# Altium schematic sheet 01_Power.SchDoc
size A4
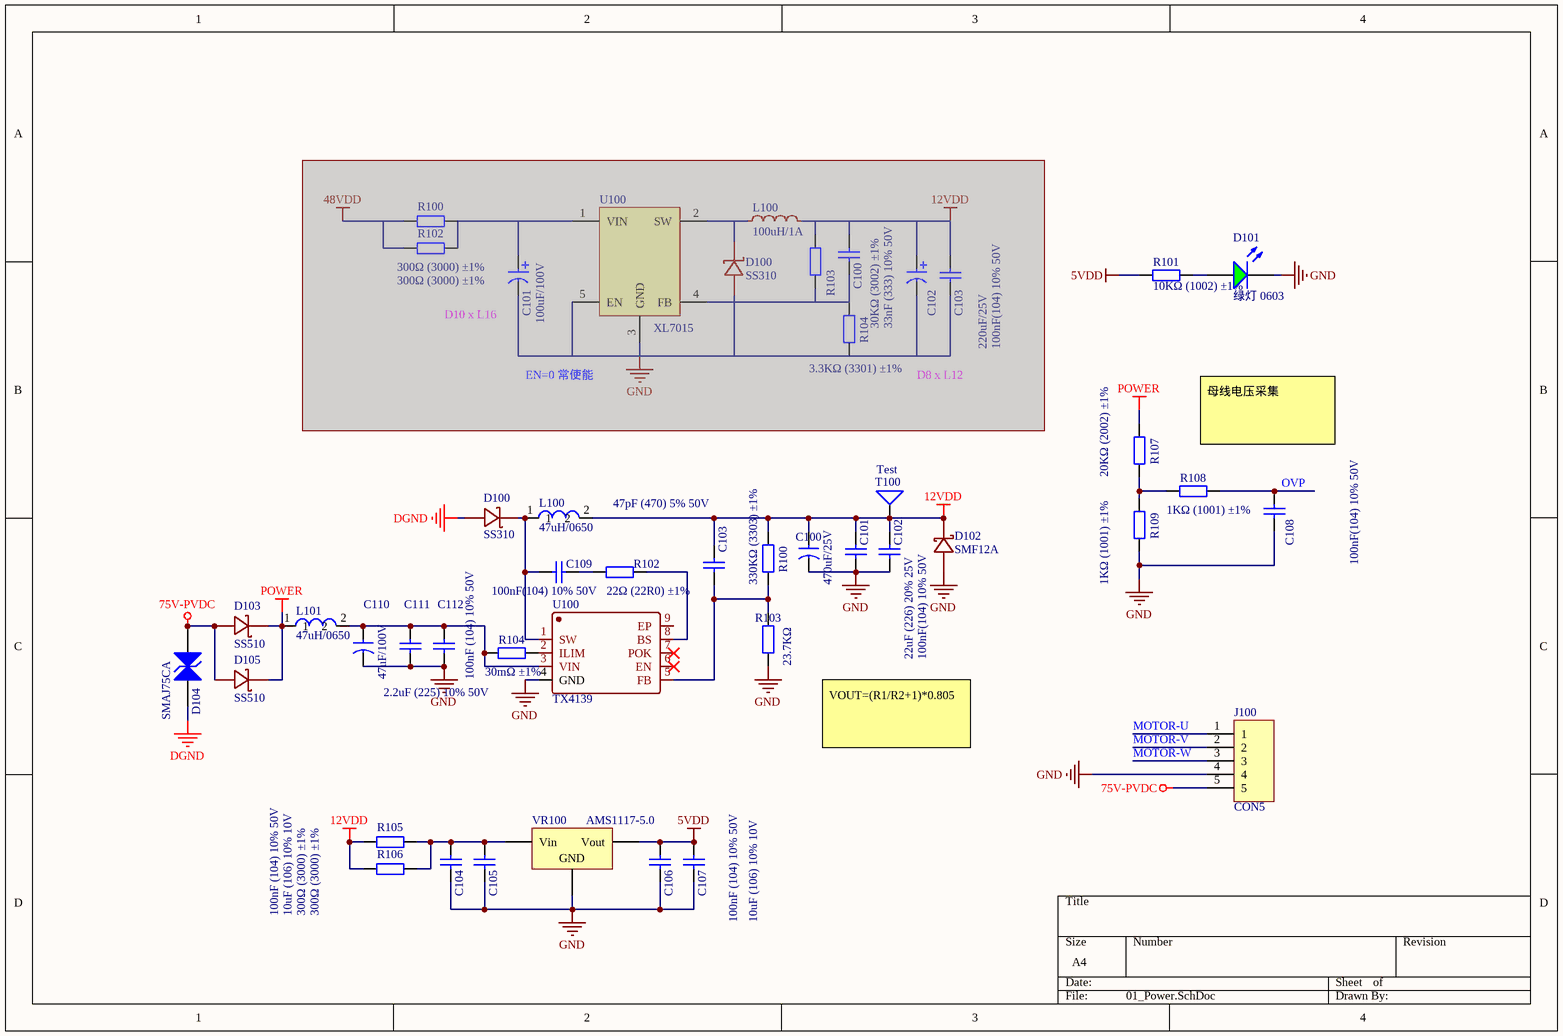
[diagram p0: 01_Power.SchDoc]

## Parts
(Parts that share a designator on the sheet are numbered #1, #2 ... from top to bottom, then left to right.)
C100#1  33nF (333) 10% 50V  [0603_C]  (masked out: inside a compile mask, not in the netlist)
C100#2  470uF/25V  [47UF/100V]
C101#1  100uF/100V  [CAP_D10_L16]  (masked out: inside a compile mask, not in the netlist)
C101#2  22uF (226) 20% 25V  [0805_C]
C102#1  220uF/25V  [CAP_D8_L12]  (masked out: inside a compile mask, not in the netlist)
C102#2  100nF(104) 10% 50V  [0805_C]
C103#1  100nF(104) 10% 50V  [0805_C]  (masked out: inside a compile mask, not in the netlist)
C103#2  47pF (470) 5% 50V  [0805_C]
C104  100nF (104) 10% 50V  [0603_C]
C105  10uF (106) 10% 10V  [0603_C]
C106  100nF (104) 10% 50V  [0603_C]
C107  10uF (106) 10% 10V  [0603_C]
C108  100nF(104) 10% 50V  [0805_C]
C109  100nF(104) 10% 50V  [0805_C]
C110  47uF/100V  [47UF/100V]
C111  2.2uF (225) 10% 50V  [1206_C]
C112  100nF (104) 10% 50V  [1206_C]
D100#1  SS310  [SS310]  (masked out: inside a compile mask, not in the netlist)
D100#2  SS310  [SS310]
D101  绿灯 0603  [0603_LED_S1]
D102  SMF12A  [SMF12A - duplicate]
D103  SS510  [SS510]
D104  SMAJ75CA  [SMB(DO-214AA)_S1]
D105  SS510  [SS510]
J100  CON5  [7.62-5P 端子]
L100#1  100uH/1A  [L_D9.5_L12]  (masked out: inside a compile mask, not in the netlist)
L100#2  47uH/0650  [0650_47uH]
L101  47uH/0650  [0650_47uH]
R100#1  300Ω (3000) ±1%  [1206_R]  (masked out: inside a compile mask, not in the netlist)
R100#2  330KΩ (3303) ±1%  [0805_R]
R101  10KΩ (1002) ±1%  [0603_R]
R102#1  300Ω (3000) ±1%  [1206_R]  (masked out: inside a compile mask, not in the netlist)
R102#2  22Ω (22R0) ±1%  [0805_R]
R103#1  30KΩ (3002) ±1%  [0603_R]  (masked out: inside a compile mask, not in the netlist)
R103#2  23.7KΩ  [0805_R]
R104#1  3.3KΩ (3301) ±1%  [0603_R]  (masked out: inside a compile mask, not in the netlist)
R104#2  30mΩ ±1%  [LC-0603_R]
R105  300Ω (3000) ±1%  [1206_R]
R106  300Ω (3000) ±1%  [1206_R]
R107  20KΩ (2002) ±1%  [0805_R]
R108  1KΩ (1001) ±1%  [0805_R]
R109  1KΩ (1001) ±1%  [0805_R]
T100  Test  [Testpoint]
U100#1  XL7015  [XL7015]  (masked out: inside a compile mask, not in the netlist)
U100#2  TX4139  [ESOP8]
VR100  AMS1117-5.0  [SOT-223]

## Nets
5VDD: C106.2 C107.2 R101.2 VR100.2(Vout)
12VDD: C100#2.1 C101#2.2 C102#2.2 C103#2.2 D102.1(K) L100#2.2 R100#2.2 R105.1 R106.1 T100.1
75V-PVDC: D103.2 D104.1(A) D105.2 J100.5
DGND: D100#2.2(A) D104.2(K)
GND: C100#2.2 C101#2.1 C102#2.1 C104.1 C105.1 C106.1 C107.1 C108.1 C110.2 C111.1 C112.1 D101.K D102.2(A) J100.4 R103#2.1 R109.1 U100#2.4(GND) VR100.1(GND)
POWER: D103.1 D105.1 L101.1 R107.2
MOTOR-U: J100.1
MOTOR-V: J100.2
MOTOR-W: J100.3
OVP: C108.2 R108.1
NetC103#2_1: C103#2.1 R100#2.1 R103#2.2 U100#2.5(FB)
NetC104_2: C104.2 C105.2 R105.2 R106.2 VR100.3(Vin)
NetC109_1: C109.1 D100#2.1(K) L100#2.1 U100#2.1(SW)
NetC109_2: C109.2 R102#2.1
NetC110_1: C110.1 C111.2 C112.2 L101.2 R104#2.2 U100#2.3(VIN)
NetD101_A: D101.A R101.1
NetR102#2_2: R102#2.2 U100#2.8(BS)
NetR104#2_1: R104#2.1 U100#2.2(ILIM)
NetR107_1: R107.1 R108.2 R109.2

Not connected (* = marked no-connect by the designer): U100#2 6(EN)* 7(POK)* 9(EP)

## Notes on the sheet
- (near C101#1) D10 x L16
- EN=0 常使能
- D8 x L12
- 母线电压采集
- VOUT=(R1/R2+1)*0.805

## Library data of the parts
C100#1 = 0603 33nF (333) 10% 50V: 贴片电容; ComponentLink1Description: 供应商链接; ComponentLink1URL: http://www.szlcsc.com/product/details_21829.html; Package: 0603; Supplier: LC; SuppliersPartNumber: C21117
C100#2 C110 = CapSMT220u_16V
C101#1 C102#1 = CAP2: 电解电容
C101#2 = 0805 22uF (226) 20% 25V: 贴片电容; ComponentLink1Description: 供应商链接; ComponentLink1URL: http://www.szlcsc.com/product/details_46786.html; Package: 0805; Supplier: LC; SuppliersPartNumber: C45783
C102#2 C103#1 C108 C109 = 0805 100nF(104) 10% 50V: 贴片电容; ComponentLink1Description: 供应商链接; ComponentLink1URL: http://www.szlcsc.com/product/details_50686.html; Package: 0805; Supplier: LC; SuppliersPartNumber: C49678
C103#2 = 0805 47pF (470) 5% 50V: 贴片电容; ComponentLink1Description: 供应商链接; ComponentLink1URL: http://www.szlcsc.com/product/details_15529.html; Package: 0805; Supplier: LC; SuppliersPartNumber: C14857
C104 C106 = 0603 100nF (104) 10% 50V: 贴片电容; ComponentLink1Description: 供应商链接; ComponentLink1URL: http://www.szlcsc.com/product/details_15331.html; Package: 0603; Supplier: LC; SuppliersPartNumber: C14663
C105 C107 = 0603 10uF (106) 10% 10V: 贴片电容; ComponentLink1Description: 供应商链接; ComponentLink1URL: http://www.szlcsc.com/product/details_20411.html; Package: 0603; Supplier: LC; SuppliersPartNumber: C19702
C111 = 1206 2.2uF (225) 10% 50V: 贴片电容; ComponentLink1Description: 供应商链接; ComponentLink1URL: http://www.szlcsc.com/product/details_13292.html; Package: 1206; Supplier: LC; SuppliersPartNumber: C12656
C112 = 1206 100nF (104) 10% 50V: 贴片电容; ComponentLink1Description: 供应商链接; ComponentLink1URL: http://www.szlcsc.com/product/details_25237.html; Package: 1206; Supplier: LC; SuppliersPartNumber: C24497
D101 = 0603 绿灯: 发光二极管; ComponentLink1Description: 供应商链接; ComponentLink1URL: http://www.szlcsc.com/product/details_73152.html; Package: 0603; Supplier: LC; SuppliersPartNumber: C72043
D104 = SMB/DO-214AA P6SMB6.8CA: TVS; ComponentLink1Description: 供应商链接; ComponentLink1URL: http://www.szlcsc.com/product/details_79530.html; Package: SMB/DO-214AA; Supplier: LC; SuppliersPartNumber: C78395
L100#1 = L
L100#2 L101 = Inductor
R100#1 R102#1 R105 R106 = 1206 300Ω (3000) 1%: 贴片电阻; ComponentLink1Description: 供应商链接; ComponentLink1URL: http://www.szlcsc.com/product/details_18575.html; Package: 1206; Supplier: LC; SuppliersPartNumber: C17887
R100#2 = 0805 330KΩ (3303) 1%: 贴片电阻; ComponentLink1Description: 供应商链接; ComponentLink1URL: http://www.szlcsc.com/product/details_18317.html; Package: 0805; Supplier: LC; SuppliersPartNumber: C17629
R101 = 0603 10KΩ (1002) 1%: 贴片电阻; ComponentLink1Description: 供应商链接; ComponentLink1URL: http://www.szlcsc.com/product/details_26547.html; Package: 0603; Supplier: LC; SuppliersPartNumber: C25804
R102#2 R103#2 = 0805 22Ω (22R0) 1%: 贴片电阻; ComponentLink1Description: 供应商链接; ComponentLink1URL: http://www.szlcsc.com/product/details_18249.html; Package: 0805; Supplier: LC; SuppliersPartNumber: C17561
R103#1 = 0603 30KΩ (3002) 1%: 贴片电阻; ComponentLink1Description: 供应商链接; ComponentLink1URL: http://www.szlcsc.com/product/details_23711.html; Package: 0603; Supplier: LC; SuppliersPartNumber: C22984
R104#1 = 0603 3.3KΩ (3301) 1%: 贴片电阻; ComponentLink1Description: 供应商链接; ComponentLink1URL: http://www.szlcsc.com/product/details_23705.html; Package: 0603; Supplier: LC; SuppliersPartNumber: C22978
R104#2 = 0603 100KΩ (1003) 1%: 贴片电阻; ComponentLink1Description: 供应商链接; ComponentLink1URL: http://www.szlcsc.com/product/details_26546.html; Package: 0603; Supplier: LC; SuppliersPartNumber: C25803
R107 = 0805 20KΩ (2002) 1%: 贴片电阻; ComponentLink1Description: 供应商链接; ComponentLink1URL: http://www.szlcsc.com/product/details_4735.html; Package: 0805; Supplier: LC; SuppliersPartNumber: C4328
R108 R109 = 0805 1KΩ (1001) 1%: 贴片电阻; ComponentLink1Description: 供应商链接; ComponentLink1URL: http://www.szlcsc.com/product/details_18201.html; Package: 0805; Supplier: LC; SuppliersPartNumber: C17513
T100 = TestPad
VR100 = SOT-223 AMS1117-5.0: 低压差线性稳压(LDO); ComponentLink1Description: 供应商链接; ComponentLink1URL: http://www.szlcsc.com/product/details_6653.html; Package: SOT-223; Supplier: LC; SuppliersPartNumber: C6187